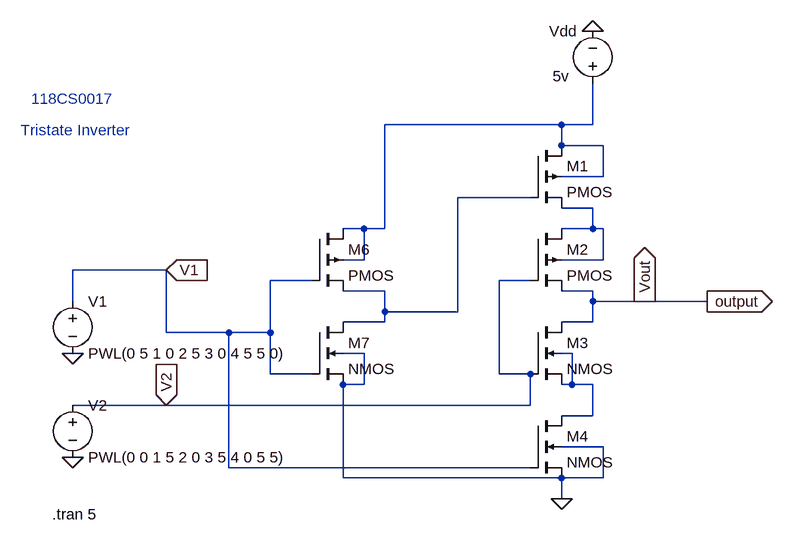
[diagram p0: schematic Draft10.asc]
Draft10.asc, the LTspice schematic file:
Version 4
SHEET 1 880 680
WIRE 288 32 16 32
WIRE 336 32 336 -32
WIRE 336 32 288 32
WIRE 288 64 288 32
WIRE 352 64 288 64
WIRE 352 112 352 64
WIRE 352 112 288 112
WIRE 240 144 128 144
WIRE 336 160 288 160
WIRE -16 192 -48 192
WIRE 16 192 16 32
WIRE 16 192 -16 192
WIRE 336 192 336 160
WIRE 336 192 288 192
WIRE 352 192 336 192
WIRE -16 240 -16 192
WIRE -16 240 -48 240
WIRE 352 240 352 192
WIRE 352 240 288 240
WIRE -320 256 -464 256
WIRE -96 272 -160 272
WIRE 240 272 192 272
WIRE 16 288 -48 288
WIRE 336 288 288 288
WIRE -464 304 -464 256
WIRE 336 304 336 288
WIRE 416 304 336 304
WIRE 512 304 416 304
WIRE 16 320 16 288
WIRE 128 320 128 144
WIRE 128 320 16 320
WIRE 16 336 16 320
WIRE 16 336 -48 336
WIRE 336 336 336 304
WIRE 336 336 288 336
WIRE -320 352 -320 256
WIRE -224 352 -320 352
WIRE -160 352 -160 272
WIRE -160 352 -224 352
WIRE -16 384 -48 384
WIRE 304 384 288 384
WIRE -160 416 -160 352
WIRE -96 416 -160 416
WIRE 192 416 192 272
WIRE 240 416 192 416
WIRE -16 432 -16 384
WIRE -16 432 -48 432
WIRE 304 432 304 384
WIRE 304 432 288 432
WIRE 336 432 304 432
WIRE -320 464 -464 464
WIRE 240 464 240 416
WIRE 240 464 -320 464
WIRE 336 480 336 432
WIRE 336 480 288 480
WIRE 352 528 288 528
WIRE -224 560 -224 352
WIRE 240 560 -224 560
WIRE -48 576 -48 432
WIRE 288 576 -48 576
WIRE 352 576 352 528
WIRE 352 576 288 576
WIRE 288 608 288 576
FLAG 288 608 0
FLAG -464 384 0
FLAG -464 544 0
FLAG 336 -112 0
FLAG 512 304 output
IOPIN 512 304 Out
FLAG -320 256 V1
IOPIN -320 256 In
FLAG -320 464 V2
IOPIN -320 464 In
FLAG 416 304 Vout
IOPIN 416 304 Out
SYMBOL pmos4 240 64 R0
SYMATTR InstName M1
SYMBOL pmos4 240 192 R0
SYMATTR InstName M2
SYMBOL nmos4 240 336 R0
SYMATTR InstName M3
SYMBOL nmos4 240 480 R0
SYMATTR InstName M4
SYMBOL pmos4 -96 192 R0
SYMATTR InstName M6
SYMBOL nmos4 -96 336 R0
SYMATTR InstName M7
SYMBOL voltage -464 288 R0
WINDOW 123 0 0 Left 0
WINDOW 39 0 0 Left 0
SYMATTR InstName V1
SYMATTR Value PWL(0 5 1 0 2 5 3 0 4 5 5 0)
SYMBOL voltage -464 448 R0
WINDOW 123 0 0 Left 0
WINDOW 39 0 0 Left 0
SYMATTR InstName V2
SYMATTR Value PWL(0 0 1 5 2 0 3 5 4 0 5 5)
SYMBOL voltage 336 -16 R180
WINDOW 0 24 96 Left 2
WINDOW 3 36 27 Left 2
WINDOW 123 0 0 Left 0
WINDOW 39 0 0 Left 0
SYMATTR InstName Vdd
SYMATTR Value 5v
TEXT -496 632 Left 2 !.tran 5
TEXT -528 -8 Left 2 ;118CS0017
TEXT -544 40 Left 2 ;Tristate Inverter

The netlist it stands for:
* Draft10.asc
M1 N001 N002 N003 N001 PMOS
M2 N003 V2 Vout N003 PMOS
M3 Vout V2 N004 N004 NMOS
M4 N004 V1 0 0 NMOS
M6 N001 V1 N002 N001 PMOS
M7 N002 V1 0 0 NMOS
V1 V1 0 PWL(0 5 1 0 2 5 3 0 4 5 5 0)
V2 V2 0 PWL(0 0 1 5 2 0 3 5 4 0 5 5)
Vdd N001 0 5v
.model NMOS NMOS
.model PMOS PMOS
.lib standard.mos
.tran 5
* 118CS0017
* Tristate Inverter
.backanno
.end